# Altium schematic sheet TIDA-010933-DCDC-Top.SchDoc
size 431 x 279 mm; Date: Not shown in title block; ApprovedBy: Not shown in title block; CheckedBy: Not shown in title block; Author: Not shown in title block; CompanyName: Not shown in title block; Engineer: Not shown in title block; Organization: Not shown in title block; Address1: Not shown in title block; Address2: Not shown in title block; Address3: Not shown in title block; Address4: Not shown in title block; DocumentNumber: 2; Revision: Use project parameter SCH_Rev; SheetNumber: 1; SheetTotal: 11; PageSetup: Record=PageOptions|CenterHorizontal=True|CenterVertical=True|PrintScale=1.00|XCorrection=1.00|YCorrection=1.00|PrintKind=0|BorderSize=5000000|LeftOffset=0|BottomOffset=0|Orientation=2|PaperLength=1000|PaperWidth=1000|Scale=100|PaperSource=15|PrintQuality=600|MediaType=1|DitherType=10|PaperKind=Letter|PrintScaleMode=1; CurrentTime: Not shown in title block; CurrentDate: Not shown in title block; Time: Not shown in title block; DocumentFullPathAndName: Not shown in title block; DocumentName: Not shown in title block; ModifiedDate: 1/25/2022; ImagePath: Not shown in title block
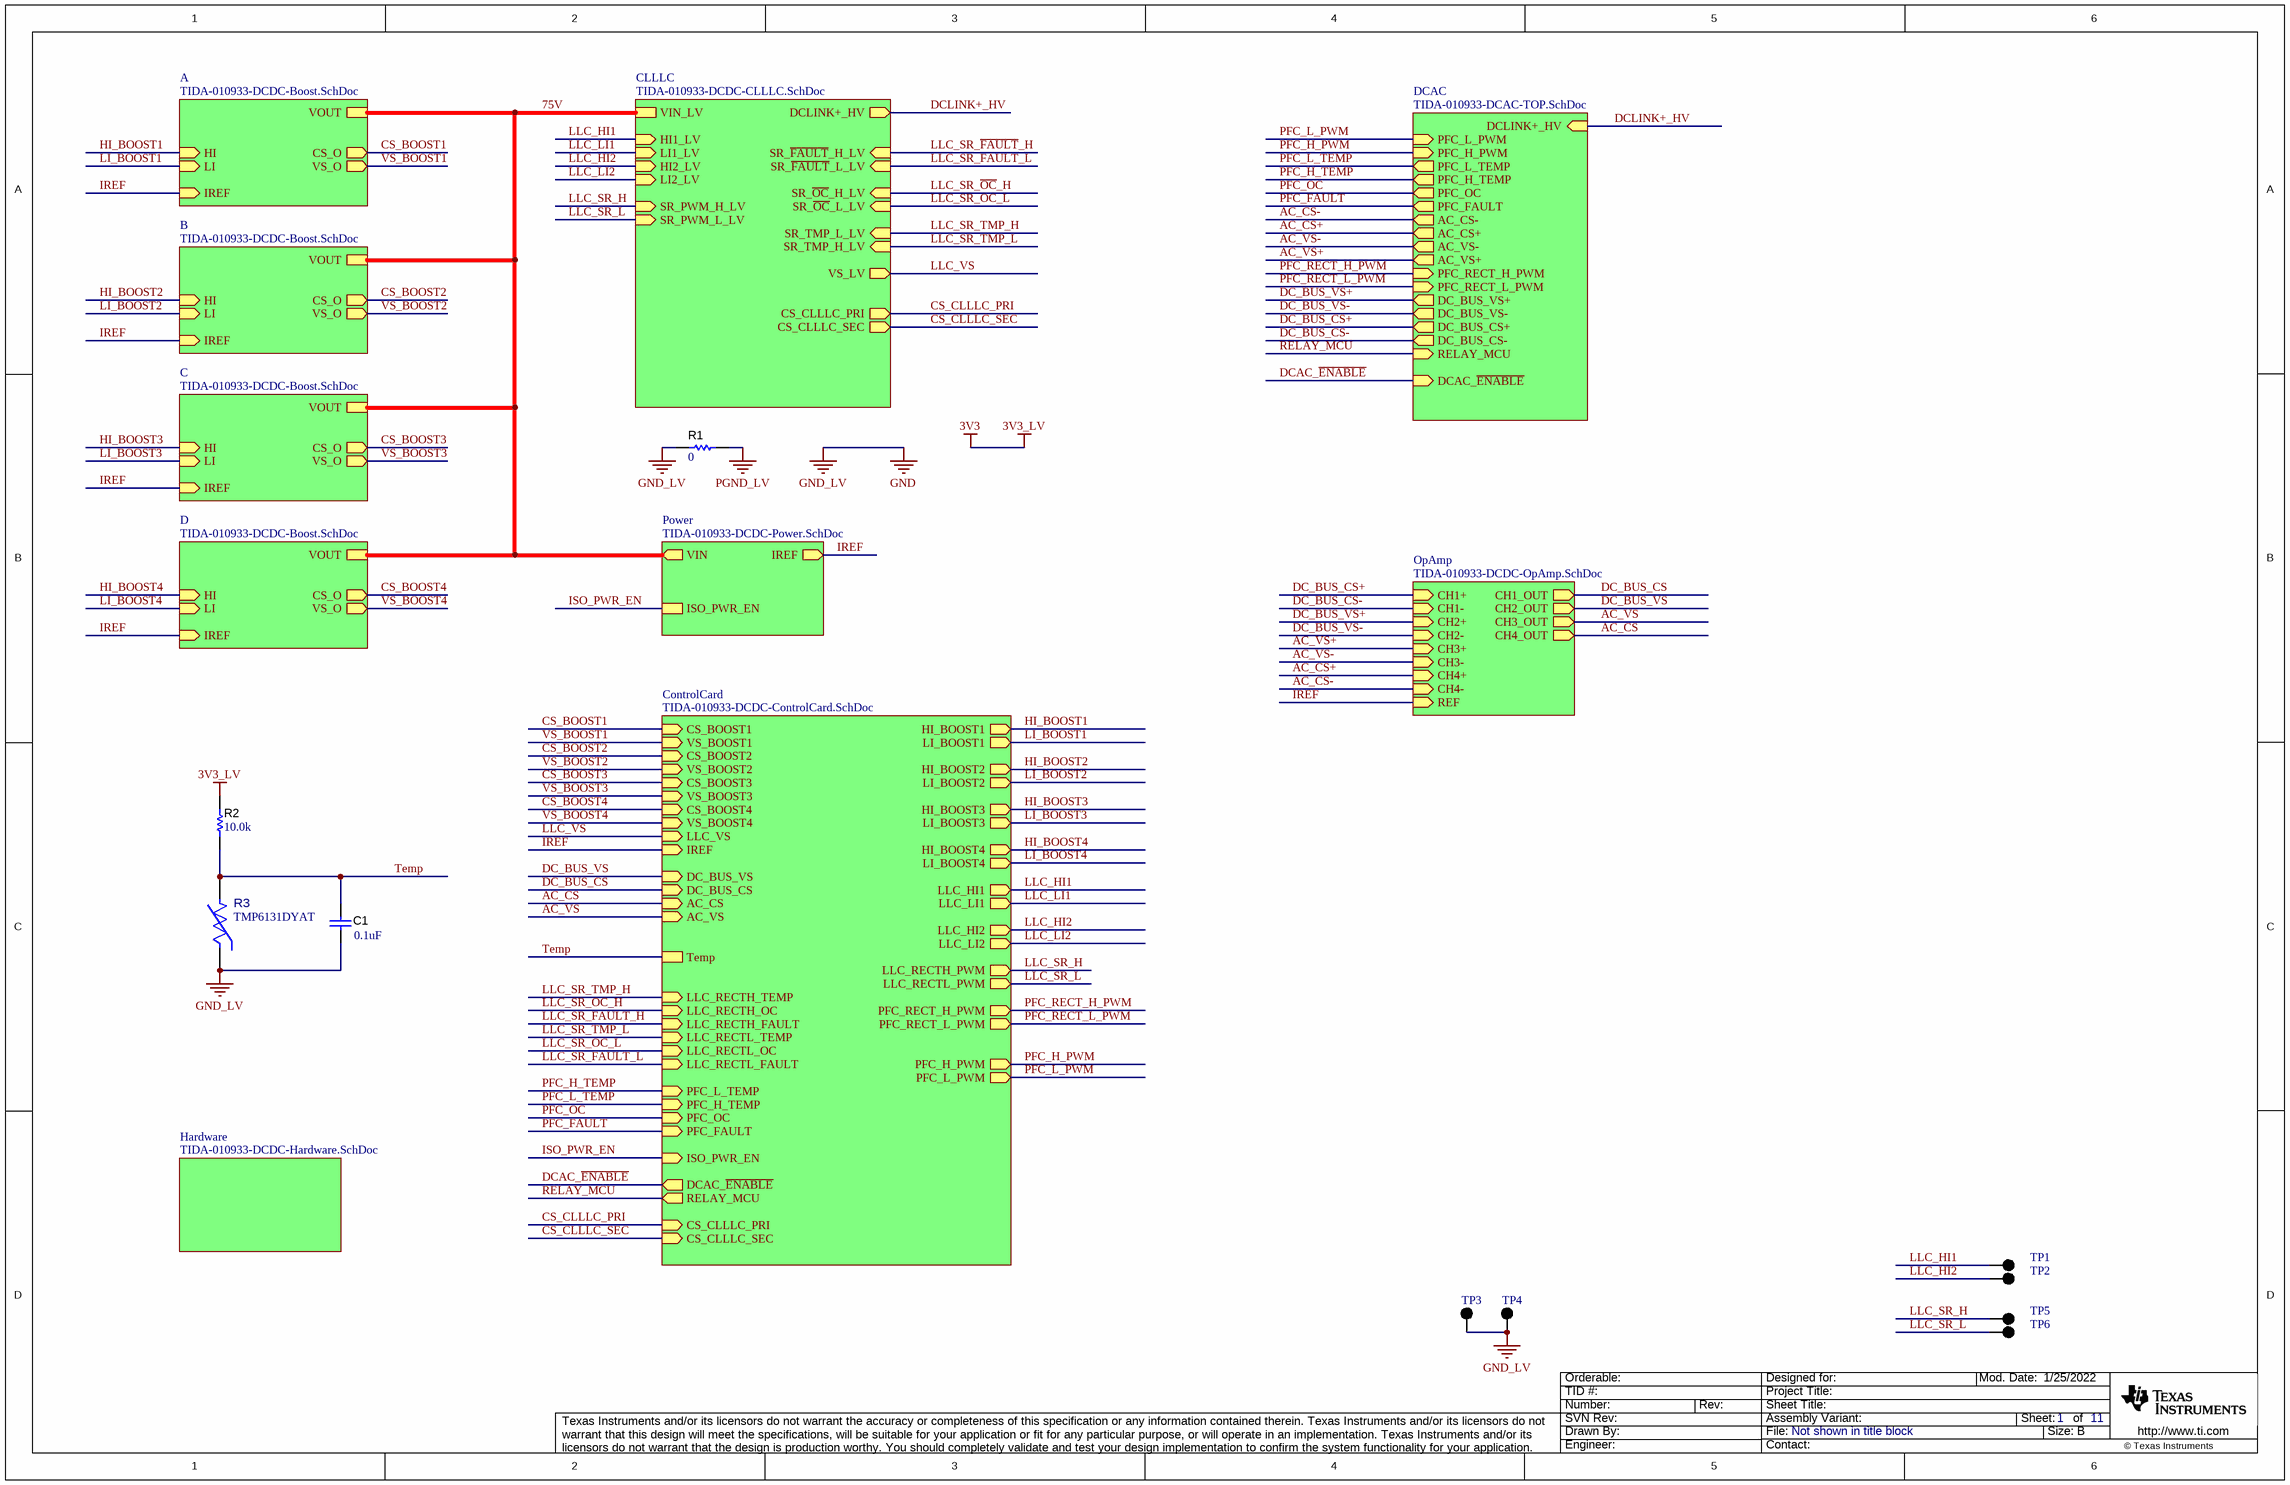
[diagram p0: TIDA-010933-DCDC-Top.SchDoc]

## Parts
C1  ValueDisplayed: 0.1uF  [0402]  (hidden comment: GRM155R71E104KE14D)
R1  ValueDisplayed: 0  [0603]  (hidden comment: RC0603JR-070RL)
R2  ValueDisplayed: 10.0k  [0402]  (hidden comment: RT0402BRD0710KL)
R3  TMP6131DYAT  [DYA0002A-MFG]
TP1  5001  [Keystone5001]  (value not drawn)
TP2  5001  [Keystone5001]  (value not drawn)
TP3  5001  [Keystone5001]  (value not drawn)
TP4  5001  [Keystone5001]  (value not drawn)
TP5  5001  [Keystone5001]  (value not drawn)
TP6  5001  [Keystone5001]  (value not drawn)

## Sub-sheets
A = TIDA-010933-DCDC-Boost.SchDoc: HI (in), LI (in), VOUT, CS_O (out), VS_O (out), IREF (in)
B = TIDA-010933-DCDC-Boost.SchDoc: HI (in), LI (in), VOUT, CS_O (out), VS_O (out), IREF (in)
C = TIDA-010933-DCDC-Boost.SchDoc: HI (in), LI (in), VOUT, CS_O (out), VS_O (out), IREF (in)
CLLLC = TIDA-010933-DCDC-CLLLC.SchDoc: VIN_LV, HI1_LV (in), LI1_LV (in), HI2_LV (in), LI2_LV (in), SR_PWM_H_LV (in), SR_PWM_L_LV (in), SR_~{FAULT}_L_LV (in), SR_~{FAULT}_H_LV (in), SR_~{OC}_H_LV (in), SR_~{OC}_L_LV (in), SR_TMP_L_LV (in), SR_TMP_H_LV (in), DCLINK+_HV (out), VS_LV (out), CS_CLLLC_PRI (out), CS_CLLLC_SEC (out)
ControlCard = TIDA-010933-DCDC-ControlCard.SchDoc: CS_BOOST1 (in), VS_BOOST1 (in), CS_BOOST2 (in), VS_BOOST2 (in), CS_BOOST3 (in), VS_BOOST3 (in), CS_BOOST4 (in), VS_BOOST4 (in), DC_BUS_VS (in), DC_BUS_CS (in), LLC_VS (in), IREF (in), LLC_HI1 (out), LLC_HI2 (out), LLC_LI1 (out), LLC_LI2 (out), LLC_RECTH_TEMP (in), LLC_RECTL_TEMP (in), PFC_H_TEMP (in), PFC_L_TEMP (in), PFC_OC (in), PFC_FAULT (in), HI_BOOST1 (out), LI_BOOST1 (out), HI_BOOST2 (out), LI_BOOST2 (out), HI_BOOST3 (out), LI_BOOST3 (out), HI_BOOST4 (out), LI_BOOST4 (out), LLC_RECTH_OC (in), LLC_RECTH_FAULT (in), LLC_RECTL_OC (in), LLC_RECTL_FAULT (in), AC_CS (in), AC_VS (in), LLC_RECTH_PWM (out), LLC_RECTL_PWM (out), PFC_RECT_H_PWM (out), PFC_RECT_L_PWM (out), PFC_H_PWM (out), PFC_L_PWM (out), ISO_PWR_EN (in), DCAC_~{ENABLE} (out), RELAY_MCU (out), Temp, CS_CLLLC_PRI (in), CS_CLLLC_SEC (in)
D = TIDA-010933-DCDC-Boost.SchDoc: HI (in), LI (in), VOUT, CS_O (out), VS_O (out), IREF (in)
DCAC = TIDA-010933-DCAC-TOP.SchDoc: DCLINK+_HV (in), PFC_L_PWM (in), PFC_H_PWM (in), PFC_L_TEMP (out), PFC_H_TEMP (out), PFC_OC (out), PFC_FAULT (out), AC_CS- (out), AC_CS+ (out), AC_VS- (out), AC_VS+ (out), PFC_RECT_H_PWM (in), PFC_RECT_L_PWM (in), DC_BUS_VS+ (out), DC_BUS_VS- (out), DC_BUS_CS+ (out), DC_BUS_CS- (out), RELAY_MCU (in), DCAC_~{ENABLE} (in)
Hardware = TIDA-010933-DCDC-Hardware.SchDoc: no entries
OpAmp = TIDA-010933-DCDC-OpAmp.SchDoc: CH1+ (in), CH1- (in), REF (in), CH2+ (in), CH2- (in), CH3+ (in), CH3- (in), CH4+ (in), CH4- (in), CH1_OUT (out), CH2_OUT (out), CH3_OUT (out), CH4_OUT (out)
Power = TIDA-010933-DCDC-Power.SchDoc: IREF (out), VIN (out), ISO_PWR_EN

## Nets
3V3: R2.2  [also labelled 3V3_LV]
GND: C1.2 R1.1 R3.2(+) TP3.1 TP4.1  [also labelled GND_LV]
PGND_LV: R1.2
75V: sheet A/VOUT, sheet CLLLC/VIN_LV, sheet B/VOUT, sheet C/VOUT, sheet D/VOUT, sheet Power/VIN
AC_CS: sheet ControlCard/AC_CS, sheet OpAmp/CH4_OUT
AC_CS+: sheet OpAmp/CH4+, sheet DCAC/AC_CS+
AC_CS-: sheet OpAmp/CH4-, sheet DCAC/AC_CS-
AC_VS: sheet ControlCard/AC_VS, sheet OpAmp/CH3_OUT
AC_VS+: sheet OpAmp/CH3+, sheet DCAC/AC_VS+
AC_VS-: sheet OpAmp/CH3-, sheet DCAC/AC_VS-
CS_BOOST1: sheet A/CS_O, sheet ControlCard/CS_BOOST1
CS_BOOST2: sheet B/CS_O, sheet ControlCard/CS_BOOST2
CS_BOOST3: sheet C/CS_O, sheet ControlCard/CS_BOOST3
CS_BOOST4: sheet D/CS_O, sheet ControlCard/CS_BOOST4
CS_CLLLC_PRI: sheet CLLLC/CS_CLLLC_PRI, sheet ControlCard/CS_CLLLC_PRI
CS_CLLLC_SEC: sheet CLLLC/CS_CLLLC_SEC, sheet ControlCard/CS_CLLLC_SEC
DC_BUS_CS: sheet ControlCard/DC_BUS_CS, sheet OpAmp/CH1_OUT
DC_BUS_CS+: sheet OpAmp/CH1+, sheet DCAC/DC_BUS_CS+
DC_BUS_CS-: sheet OpAmp/CH1-, sheet DCAC/DC_BUS_CS-
DC_BUS_VS: sheet ControlCard/DC_BUS_VS, sheet OpAmp/CH2_OUT
DC_BUS_VS+: sheet OpAmp/CH2+, sheet DCAC/DC_BUS_VS+
DC_BUS_VS-: sheet OpAmp/CH2-, sheet DCAC/DC_BUS_VS-
DCAC_~{ENABLE}: sheet ControlCard/DCAC_~{ENABLE}, sheet DCAC/DCAC_~{ENABLE}
DCLINK+_HV: sheet CLLLC/DCLINK+_HV, sheet DCAC/DCLINK+_HV
HI_BOOST1: sheet A/HI, sheet ControlCard/HI_BOOST1
HI_BOOST2: sheet B/HI, sheet ControlCard/HI_BOOST2
HI_BOOST3: sheet C/HI, sheet ControlCard/HI_BOOST3
HI_BOOST4: sheet D/HI, sheet ControlCard/HI_BOOST4
IREF: sheet A/IREF, sheet B/IREF, sheet C/IREF, sheet D/IREF, sheet Power/IREF, sheet ControlCard/IREF, sheet OpAmp/REF
ISO_PWR_EN: sheet Power/ISO_PWR_EN, sheet ControlCard/ISO_PWR_EN
LI_BOOST1: sheet A/LI, sheet ControlCard/LI_BOOST1
LI_BOOST2: sheet B/LI, sheet ControlCard/LI_BOOST2
LI_BOOST3: sheet C/LI, sheet ControlCard/LI_BOOST3
LI_BOOST4: sheet D/LI, sheet ControlCard/LI_BOOST4
LLC_HI1: TP1.1 ; sheet CLLLC/HI1_LV, sheet ControlCard/LLC_HI1
LLC_HI2: TP2.1 ; sheet CLLLC/HI2_LV, sheet ControlCard/LLC_HI2
LLC_LI1: sheet CLLLC/LI1_LV, sheet ControlCard/LLC_LI1
LLC_LI2: sheet CLLLC/LI2_LV, sheet ControlCard/LLC_LI2
LLC_SR_~{FAULT}_H: sheet CLLLC/SR_~{FAULT}_H_LV, sheet ControlCard/LLC_RECTH_FAULT
LLC_SR_~{FAULT}_L: sheet CLLLC/SR_~{FAULT}_L_LV, sheet ControlCard/LLC_RECTL_FAULT
LLC_SR_H: TP5.1 ; sheet CLLLC/SR_PWM_H_LV, sheet ControlCard/LLC_RECTH_PWM
LLC_SR_L: TP6.1 ; sheet CLLLC/SR_PWM_L_LV, sheet ControlCard/LLC_RECTL_PWM
LLC_SR_~{OC}_H: sheet CLLLC/SR_~{OC}_H_LV, sheet ControlCard/LLC_RECTH_OC
LLC_SR_~{OC}_L: sheet CLLLC/SR_~{OC}_L_LV, sheet ControlCard/LLC_RECTL_OC
LLC_SR_TMP_H: sheet CLLLC/SR_TMP_L_LV, sheet ControlCard/LLC_RECTH_TEMP
LLC_SR_TMP_L: sheet CLLLC/SR_TMP_H_LV, sheet ControlCard/LLC_RECTL_TEMP
LLC_VS: sheet CLLLC/VS_LV, sheet ControlCard/LLC_VS
PFC_FAULT: sheet ControlCard/PFC_FAULT, sheet DCAC/PFC_FAULT
PFC_H_PWM: sheet ControlCard/PFC_H_PWM, sheet DCAC/PFC_H_PWM
PFC_H_TEMP: sheet ControlCard/PFC_L_TEMP, sheet DCAC/PFC_H_TEMP
PFC_L_PWM: sheet ControlCard/PFC_L_PWM, sheet DCAC/PFC_L_PWM
PFC_L_TEMP: sheet ControlCard/PFC_H_TEMP, sheet DCAC/PFC_L_TEMP
PFC_OC: sheet ControlCard/PFC_OC, sheet DCAC/PFC_OC
PFC_RECT_H_PWM: sheet ControlCard/PFC_RECT_H_PWM, sheet DCAC/PFC_RECT_H_PWM
PFC_RECT_L_PWM: sheet ControlCard/PFC_RECT_L_PWM, sheet DCAC/PFC_RECT_L_PWM
RELAY_MCU: sheet ControlCard/RELAY_MCU, sheet DCAC/RELAY_MCU
Temp: C1.1 R2.1 R3.1(-) ; sheet ControlCard/Temp
VS_BOOST1: sheet A/VS_O, sheet ControlCard/VS_BOOST1
VS_BOOST2: sheet B/VS_O, sheet ControlCard/VS_BOOST2
VS_BOOST3: sheet C/VS_O, sheet ControlCard/VS_BOOST3
VS_BOOST4: sheet D/VS_O, sheet ControlCard/VS_BOOST4

## Notes on the sheet
- Drawn By:
- SVN Rev:
- Number:
- TID #:
- Orderable:
- Rev:
- Sheet Title:
- File:
- Project Title:
- Designed for:
- Assembly Variant:
- Mod. Date:
- Sheet:
- Size:
- of
- B
- http://www.ti.com
- Texas Instruments and/or its licensors do not warrant the accuracy or completeness of this specification or any information contained therein. Texas Instruments and/or its licensors do not warrant that this design will meet the specifications, will be suitable for your application or fit for any particular purpose, or will operate in an implementation. Texas Instruments and/or its licensors do not warrant that the design is production worthy. You should completely validate and test your design implementation to confirm the system functionality for your application.
- Engineer:
- Contact:
- © Texas Instruments

## Library data of the parts
C1 = CMP-0006659-2: CAP, CERM, 0.1 uF, 25 V, +/- 10%, X7R, 0402; Manufacturer: MuRata; TaMin_C: -55°C; Polarized: N; SizeAreaWB_mm2: 3; Value1: Unknown; U/M: EA; Value: 0.1uF; TaMax_C: 125°C; SizeZ_mm: 0.6; SizeX_mm: 1; SizeY_mm: 0.5; Value2: 25V; Cap_F: 100nF; AEC Category: Q200; Supplier Part Number 2: 31Y1751; Publisher: Texas Instruments; Supplier 2: Newark; Supplier Part Number 3: 81-GRM155R71E104KE4D; TempCo: X7R; Supplier 3: Mouser; Published: 2008-06-19; RoHS: Y; MountType: SMT; Supplier 1: Digi-Key; PackageReference: 0402; Tolerance_%: 10%; Cap_Case: 0402; SizeArea_mm2: 0.5; CompType: Capacitor; LatestRevisionDate: 2017-03-09; PartNumber: GRM155R71E104KE14D; AEC Qualified: N; VDC_V: 25V; ComponentLink1Description: Datasheet link; AEC Grade: N/A; Supplier Part Number 1: 490-10698-1-ND; Technology: Ceramic; ComponentLink1URL: http://search.murata.co.jp/Ceramy/image/img/A01X/G101/ENG/GRM155R71E104KE14-01.pdf
R1 = CMP-0025885-5: RES, 0, 5%, 0.1 W, 0603; Manufacturer: Yageo; Power_W: 100mW; TempCo: 200 ppm/C; Value_Code: 0000; Value: 0; EIA_Code: E24; SizeX_mm: 1.6; SizeZ_mm: 1; Value2: 0.1W; SizeArea_mm2: 1.28; AEC Qualified: N; VDC_V: 75V; AEC Category: Q200; SizeY_mm: 0.8; SizeAreaWB_mm2: 4.68; Supplier Part Number 2: 603-RC0603JR-070RL; Supplier 2: Mouser; Supplier Part Number 3: 9233130; Supplier 3: Farnell; RoHS: Y; Value1: 5%; MountType: SMT; Supplier 1: Digi-Key; PackageReference: 0603; Tolerance_%: 5%; Res_ohm: 0; CompType: Resistor; PartNumber: RC0603JR-070RL; ComponentLink1Description: Datasheet link; Supplier Part Number 1: 311-0.0GRCT-ND; Technology: Thick Film; ComponentLink1URL: http://www.yageo.com/pdf/Pu-RC0603_51_PbFree_L_2.pdf; AEC Grade: N/A
R2 = CMP-0065360-1: RES, 10.0 k, .1%, .0625 W, 0402; Manufacturer: Yageo America; Power_W: 62.5mW; TempCo: 25 ppm/C; Value_Code: 10k0; U/M: EA; Value: 10.0k; EIA_Code: E192; Tolerance_%: 0.1%; Res_ohm: 10k; SizeX_mm: 1.0; SizeY_mm: 0.5; SizeZ_mm: 0.6; Value2: .0625W; VDC_V: 50V; AEC Category: Q200; ComponentLink1URL: http://www.yageo.com/NewPortal/yageodocoutput?fileName=/pdf/R-Chip/PYu-RT_1-to-0.01_RoHS_L_8.pdf; Supplier Part Number 2: 66R6774; Publisher: Texas Instruments; Supplier 2: Newark; Supplier Part Number 3: 603-RT0402BRD0710KL; Supplier 3: Mouser; Published: 2008-06-26; RoHS: Y; Value1: .1%; MountType: SMT; Supplier 1: Digi-Key; PackageReference: 0402; SizeArea_mm2: 0.5; CompType: Resistor; LatestRevisionDate: 2017-06-05; PartNumber: RT0402BRD0710KL; AEC Qualified: ?; ComponentLink1Description: Datasheet link; Supplier Part Number 1: YAG1346CT-ND; Technology: Thin Film
R3 = CMP-0091865-1: ±1% tolerance 10kΩ linear thermistor available in 0402 and 0603 package options 2-SOT-5X3 -40 to 125; Manufacturer: Texas Instruments; Max Current: 400uA; AEC Qualified: No; Value: 10k; TJmax_C: +155°C; TaMin_C: -40°C; TempCo: 6400ppm/°C; TaMax_C: +125°C; VDC_V: 5.5V; SizeZ_mm: 0.77mm; RoHS: TRUE; Mouser Description: ±1% tolerance 10kO linear thermistor available in 0402 and 0603 package options 2-SOT-5X3 -40 to 125; PackageReference: SOD-523; Operating Temperature Range: -40°C to +125°C; Digikey Part Number: 296-TMP6131DYATCT-ND; Res_ohm: 10kΩ; Mouser Part Number: 595-TMP6131DYAT; ComponentLink1Description: Datasheet; helpURL: https://upverter.com/upn/revision/150d27163111d799/; datasheet: https://www.ti.com/lit/gpn/TMP61; ComponentLink1URL: https://www.ti.com/lit/gpn/TMP61; Tolerance_%: 1%; Series: TMP61; Digikey Description: THERMISTOR; Datasheet Path: datasheets/Res-TMP6131DYAT.pdf; PartNumber: TMP6131DYAT; Lead Free: Yes; Part Number: TMP6131DYAT
TP1-TP6 = CMP-0055138-2: Test Point, Miniature, Black, TH; Manufacturer: Keystone Electronics; ContactFinish: Silver; CNHeader: FALSE; Green_Lifecycle: Active; Green_REACh: Passed; CT: TRUE; Color: Black; PackageReference: Black Miniature Testpoint; LatestRevisionDate: 26/05/2017; MountType: TH; Publisher: Texas Instruments; Green_EU RoHS-2: Incomplete; PartNumber: 5001; Supplier 1: Digi-Key; Supplier Part Number 1: 36-5001-ND; ComponentLink1URL: http://www.keyelco.com/userAssets/file/M60-2p60.pdf; ComponentLink1Description: Datasheet URL; RoHS: Y; Supplier 2: Mouser; Green_EU RoHS: Passed; CompType: Test Point; Supplier Part Number 2: 534-5001